# Altium schematic sheet Sheet1.SchDoc
size A
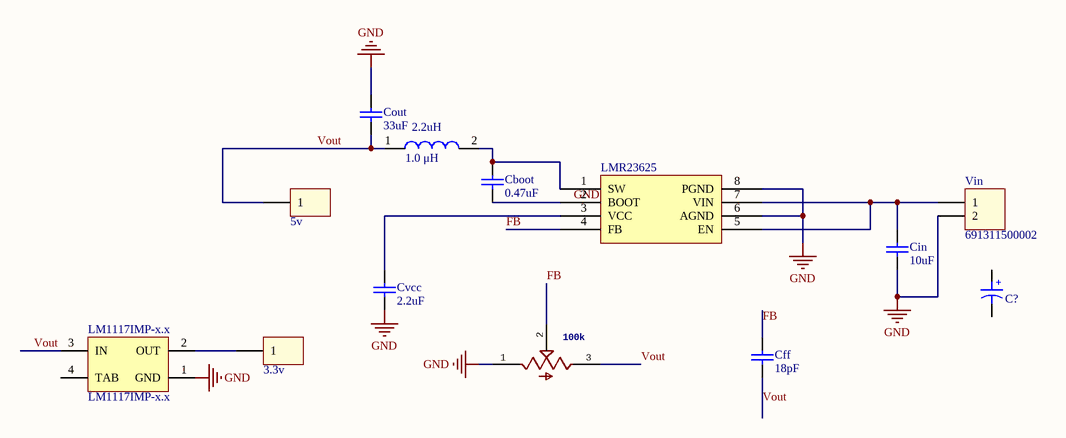
[diagram p0: Sheet1.SchDoc]

## Parts
2.2uH  1.0 μH  [WE-PDA_1210]
3.3v  61300111121  [61300111121]  (value not drawn)
5v  61300111121  [61300111121]  (value not drawn)
100k  (no value)  [TRIM_TC33X-2-104E]
C?  Cap 10x21  [Cap electrolitic radial 10x20-5]  (value not drawn)
Cboot  0.47uF  [CAPC3413X12N]
Cff  18pF  [CAPC4817X12N]
Cin  10uF  [CAPC4817X12N]
Cout  33uF  [CAPC4817X12N]
Cvcc  2.2uF  [CAPC3413X12N]
LM1117IMP-x.x  LM1117IMP-x.x  [SOT223_N]
LMR23625  (no value)  [LMR23625]
Vin  691311500002  [691311500002]

## Nets
GND: 100k.1(CCW) Cin.1 Cout.2 Cvcc.1 LM1117IMP-x.x.1(GND) LMR23625.6(AGND) LMR23625.8(PGND) Vin.2
FB: 100k.2(W) Cff.2 LMR23625.4(FB)
Vout: 2.2uH.1 5v.1 100k.3(CW) Cff.1 Cout.1 LM1117IMP-x.x.3(IN)
Net2.2uH_2: 2.2uH.2 Cboot.2 LMR23625.1(SW)
Net3.3v_1: 3.3v.1 LM1117IMP-x.x.2(OUT)
NetCboot_1: Cboot.1 LMR23625.2(BOOT)
NetCin_2: Cin.2 LMR23625.5(EN) LMR23625.7(VIN) Vin.1
NetCvcc_2: Cvcc.2 LMR23625.3(VCC)

Not connected (* = marked no-connect by the designer): C? 1 2; LM1117IMP-x.x 4(TAB)

## Notes on the sheet
- Labels drawn without touching a wire or pin: GND
- (in symbol Cap electrolitic radial 10x21) +

## Library data of the parts
2.2uH = WE-PDA 1210, 7847709010: WE-PDA SMD Shielded Power InductorInductance = 1.0 μH; Manufacturer: Wurth Elektronik; partNo: 7847709010; Inductance: 1.0 μH; ComponentLink1Description: Manufacturer; ComponentLink1URL: http://www.we-online.de; Created by: Baojun Chen; Created Date: Nov.2015; ComponentLink2Description: Datasheet; ComponentLink2URL: http://katalog.we-online.de/pbs/datasheet/7847709010.pdf
3.3v 5v = 61300111121: WR-PHD 2.54 mm THT Pin Header, 1p; Pin Number: 1; Rated Current: 3 A; Working Voltage: 250 VAC; Withstanding Voltage: 500 VAC; Pitch: 2.54 mm; ComponentLink1Description: Manufacturer; ComponentLink1URL: http://www.we-online.de; ComponentLink2Description: Datasheet; ComponentLink2URL: http://katalog.we-online.de/em/datasheet/6130xx11121.pdf; Part Number: 61300111121; Published Date: Aug 2017; Publisher: Wurth Elektronik
100k = TC33X-2-104E: MF: Bourns; Availability: Unavailable; MP: TC33X-2-104E; Price: None; Package: SOD-23 Bourns
C? = Cap electrolitic radial 10x21: Cap electrolitic radial; Part. No: 100U/50V; Designer: Abbas Basereh; Data: 16-12-2016
Cboot Cvcc = CAP SMD 0805: CAP 0805; Designer: Abbas Basereh; Desc.: CAP SMD 0805; Data: 16-12-2016
Cff Cin Cout = CAP SMD 1206: CAP 1206; Designer: Abbas Basereh; Desc.: CAP SMD 1206; Data: 16-12-2016
LM1117IMP-x.x = LM1117IMP-x.x: x.x Volt, 800mA Low-Dropout Linear Regulator, 4-pin SOT-223; PartNumber: LM1117IMP-3.3; Manufacturer: National Semiconductor; PackageTopMarking: XYTT*N05B; PowerWise: N; CompType: LDO IC; Published: 4-Dec-2008; DatasheetVersion: Apr-2006; PackageVersion: revB, Apr-2003; PackageReference: MP04A; Publisher: Altium Limited; PackageDescription: Molded SOT-223, 6.50 x 3.56 x 1.6mm Body, 4 Lead, 2.3mm Pitch; Supplier 1: Farnell; Supplier Part Number 1: 7614123; RoHS: N; PinCount: 4; Code_JEDEC: TO-261-AA; Code_IPC: SOT223-4; ComponentLink1Description: LM1117 Datasheet; ComponentLink1URL: http://www.national.com/ds/LM/LM1117.pdf; ComponentLink2Description: LM1117 Web Page; ComponentLink2URL: http://www.national.com/pf/LM/LM1117.html; ComponentLink3Description: MP04A Package Page; ComponentLink3URL: http://www.national.com/packaging/folders/mp04a.html
LMR23625 = Component_1
Vin = 691311500002: WR-TBL Serie 311 - 5.08 mm Open Vertical PCB Header, 02p; Pitch: 5.08 mm; ComponentLink1Description: Manufacturer; ComponentLink1URL: http://www.we-online.de; ComponentLink2Description: Datasheet; ComponentLink2URL: http://katalog.we-online.de/em/datasheet/6913115000xx.pdf; Part Number: 691311500002; Published Date: Feb. 2017; Publisher: Wurth Elektronik; Pin Number: 02p